# Altium schematic sheet Output_Connectors.SchDoc: =SheetTitle
size B; SheetTitle: Power Output Connectors; DrawnBy: Samyar Sadat Akhavi; SheetNumber: 17; SheetTotal: 19
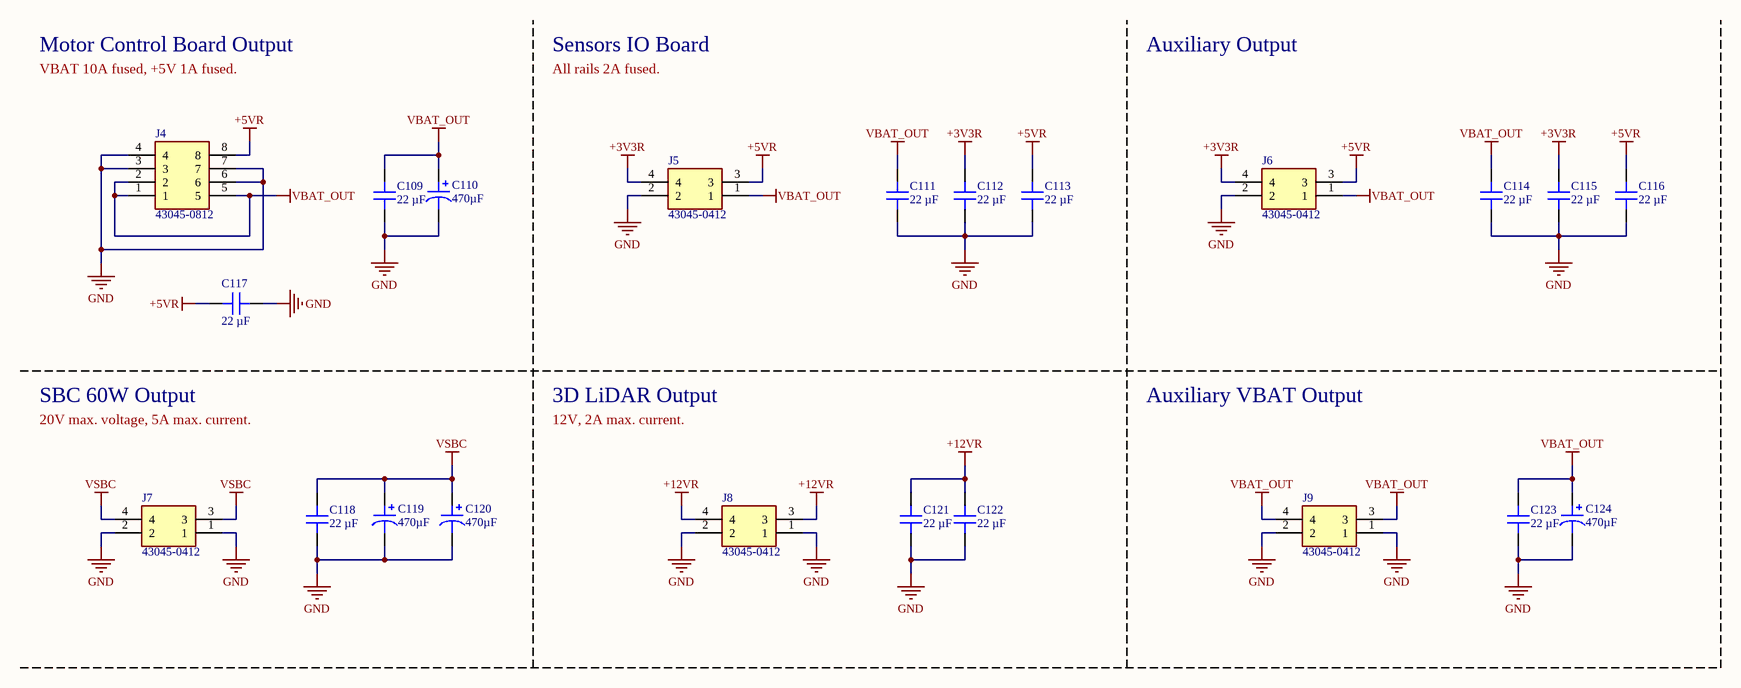
[diagram p0: Output_Connectors.SchDoc]

## Parts
?  (no value)  (graphical)
C109  22 µF  [CAP 1206_3216 - 0.8MM]
C110  470µF  [CAP_A781-MN_KEM]
C111  22 µF  [CAP 1206_3216 - 0.8MM]
C112  22 µF  [CAP 1206_3216 - 0.8MM]
C113  22 µF  [CAP 1206_3216 - 0.8MM]
C114  22 µF  [CAP 1206_3216 - 0.8MM]
C115  22 µF  [CAP 1206_3216 - 0.8MM]
C116  22 µF  [CAP 1206_3216 - 0.8MM]
C117  22 µF  [CAP 1206_3216 - 0.8MM]
C118  22 µF  [CAP 1206_3216 - 0.8MM]
C119  470µF  [CAP_A781-MN_KEM]
C120  470µF  [CAP_A781-MN_KEM]
C121  22 µF  [CAP 1206_3216 - 0.8MM]
C122  22 µF  [CAP 1206_3216 - 0.8MM]
C123  22 µF  [CAP 1206_3216 - 0.8MM]
C124  470µF  [CAP_A781-MN_KEM]
J4  43045-0812  [43045-08YY_121314]
J5  43045-0412  [43045-04YY_121314]
J6  43045-0412  [43045-04YY_121314]
J7  43045-0412  [43045-04YY_121314]
J8  43045-0412  [43045-04YY_121314]
J9  43045-0412  [43045-04YY_121314]

## Nets
+3V3R: C112.2 C115.2 J5.4 J6.4
+5VR: C113.2 C116.2 C117.2 J4.8 J5.3 J6.3
+12VR: C121.2 C122.2 J8.3 J8.4
GND: C109.1 C110.2 C111.1 C112.1 C113.1 C114.1 C115.1 C116.1 C117.1 C118.1 C119.2 C120.2 C121.1 C122.1 C123.1 C124.2 J4.3 J4.4 J4.6 J4.7 J5.2 J6.2 J7.1 J7.2 J8.1 J8.2 J9.1 J9.2
VBAT_OUT: C109.2 C110.1 C111.2 C114.2 C123.2 C124.1 J4.1 J4.2 J4.5 J5.1 J6.1 J9.3 J9.4
VSBC: C118.2 C119.1 C120.1 J7.3 J7.4

## Notes on the sheet
- Motor Control Board Output
- VBAT 10A fused, +5V 1A fused.
- Sensors IO Board
- All rails 2A fused.
- Auxiliary Output
- SBC 60W Output
- 20V max. voltage, 5A max. current.
- 3D LiDAR Output
- 12V, 2A max. current.
- Auxiliary VBAT Output
- Sub-Project:
- Size:
- Drawn By:
- Revision:
- Date:
- File:
- Sheet:
- of

## Library data of the parts
? = SGR-STDTBSB: STANDARD SCHEMATICS TITLE BLOCK
C109 C111-C118 C121-C123 = CL31A226KAHNNNE: CAP CER 22UF 25V X5R 1206; manufacturer: Samsung Electro-Mechanics; Tolerance: ±10%; Part Number: CL31A226KAHNNNE; Capacitance: 22 µF; Applications: General Purpose; componentlink1description: Datasheet; componentlink1url: http://www.samsungsem.com/kr/support/product-search/mlcc/CL31A226KAHNNNE.jsp; componentlink2description: DigiKey Link; componentlink2url: https://www.digikey.com/en/products/detail/samsung-electro-mechanics/CL31A226KAHNNNE/3888705; Device Package: 1206 (3216 Metric); lastupdated: 4/6/2026 7:37:25 PM; Lifecycle Status: Active; Minimum Order: 1; Mounting Type: Surface Mount, MLCC; Operating Temperature: -55°C ~ 85°C; Package / Case: 1206 (3216 Metric); packaging: TapeAndReel; partid: 22185; Part Status: Active; price: 0.06; series: CL; Size / Dimension: 0.126" L x 0.063" W (3.20mm x 1.60mm); Supplier 1: DigiKey; Supplier Part Number 1: 1276-3047-1-ND; Temperature Coefficient: X5R; Thickness (Max): 0.071" (1.80mm); value: 22 µF; Voltage - Rated: 25V
C110 C119 C120 C124 = A781MN477M1ELAS025: CAP ALUM HYB 470UF 20% 25V SMD; Manufacturer: KEMET; ESR: 25mOhm; Lifetime Temp: 2000 Hrs @ 135°C; Part Number: A781MN477M1ELAS025; Value: 470µF; Tolerance: ±20%; Voltage: 25V; Supplier 1: DigiKey; Supplier Part Number 1: 399-A781MN477M1ELAS025CT-ND
J4 = 43045-0812: CONN HEADER VERT 8POS 3MM; Manufacturer: Molex; Part Number: 43045-0812; Supplier 1: DigiKey; Supplier Part Number 1: WM1792-ND
J5-J9 = 43045-0412: CONN HEADER VERT 4POS 3MM; Manufacturer: Molex; Part Number: 43045-0412; Supplier 1: DigiKey; Supplier Part Number 1: WM1790-ND